# EAGLE design LightController (EAGLE 6.4)
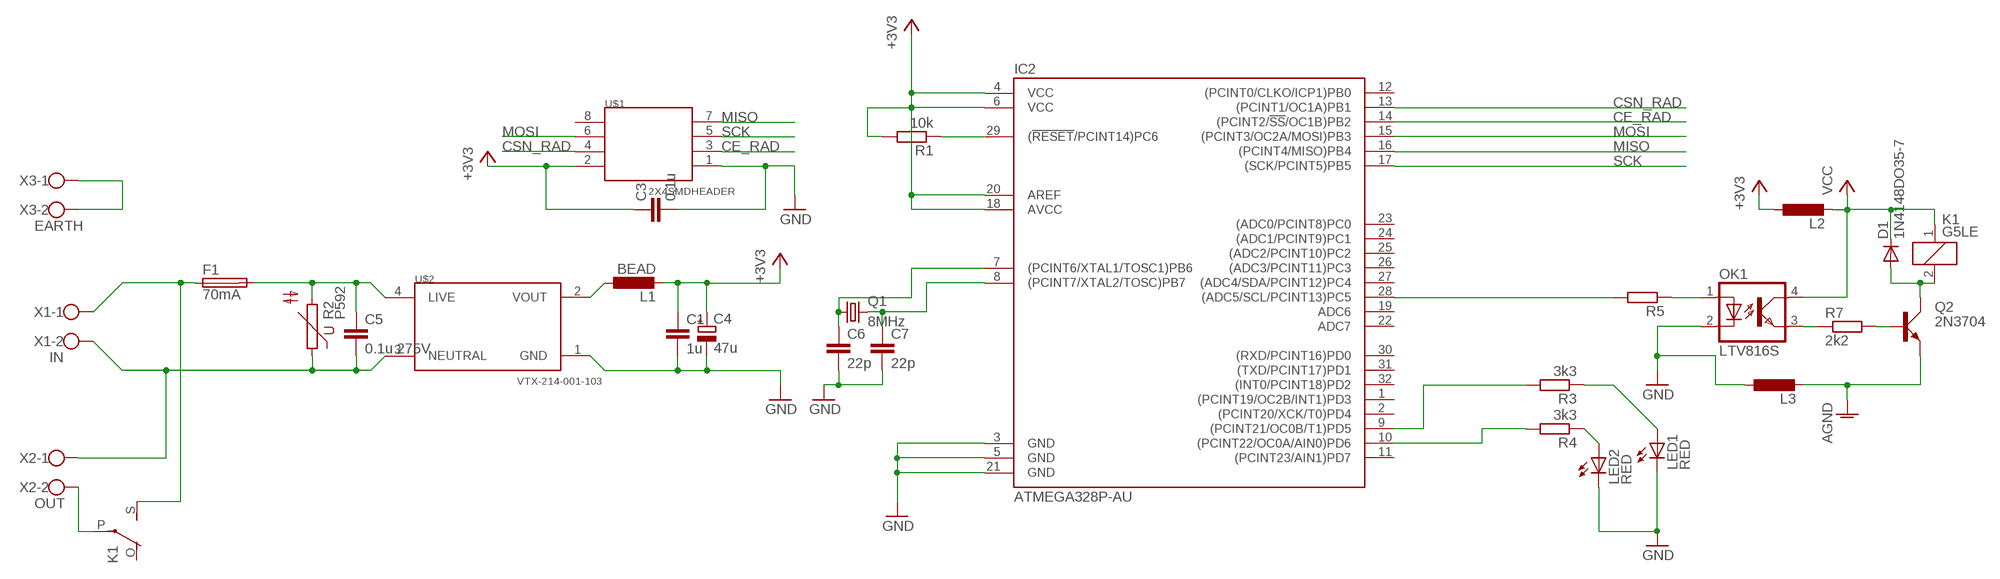
[diagram p0: schematic, sheet 1]

## Parts
C1  1u  C-EUC1206K  [C1206K]
C3  0.1u  C-EUC1206  [C1206]
C4  47u  CPOL-EUE2,5-6E  [E2,5-6E]
C5  0.1u 275V  C15/5  [C15B5]
C6  22p  C-EUC1206  [C1206]
C7  22p  C-EUC1206  [C1206]
D1  1N4148DO35-7  [DO35-7]
F1  70mA  FUSESH22,5A  [SH22,5A]
IC2  ATMEGA328P-AU  [TQFP32-08]
K1  G5LE  [G5LE]
L1  BEAD  L-EUL3230M  [L3230M]
L2  L-EUL3230M  [L3230M]
L3  L-EUL3230M  [L3230M]
LED1  RED  LEDSMT1206  [1206]
LED2  RED  LEDSMT1206  [1206]
OK1  LTV816S  [DIL4-SMD]
Q1  8MHz  CRYSTALHC49U70  [HC49U70]
Q2  2N3704  [TO92C]
R1  10k  R-EU_R1206  [R1206]
R2  P592  [P592]
R3  3k3  R-EU_R1206  [R1206]
R4  3k3  R-EU_R1206  [R1206]
R5  R-EU_R1206  [R1206]
R7  2k2  R-EU_R1206  [R1206]
U$1  2X4SMDHEADER  [TSM-110-XX-XXX-DV]
U$2  VTX-214-001-103  [VTX214001103]
X1  IN  W237-102  [W237-102]
X2  OUT  W237-102  [W237-102]
X3  EARTH  W237-102  [W237-102]

## Nets
+3V3: C1.1 C3.1 C4.+ IC2.4(VCC) IC2.6(VCC) IC2.18(AVCC) IC2.20(AREF) L1.2 L2.1 R1.2 U$1.2
AGND: L3.2 Q2.E
CE_RAD: IC2.14((PCINT2/!SS!/OC1B)PB2) U$1.3
CSN_RAD: IC2.13((PCINT1/OC1A)PB1) U$1.4
GND: C1.2 C3.2 C4.- C6.2 C7.2 IC2.3(GND) IC2.5(GND) IC2.21(GND) L3.1 LED1.C LED2.C OK1.2(C) U$1.1 U$2.1(GND)
MISO: IC2.16((PCINT4/MISO)PB4) U$1.7
MOSI: IC2.15((PCINT3/OC2A/MOSI)PB3) U$1.6
N$1: F1.1 K1.S(2:S) X1.1
N$2: C5.1 F1.2 R2.2 U$2.4(LIVE)
N$3: IC2.29((!RESET!/PCINT14)PC6) R1.1
N$4: C5.2 R2.1 U$2.3(NEUTRAL) X1.2 X2.1
N$5: IC2.10((PCINT22/OC0A/AIN0)PD6) R4.2
N$6: LED1.A R3.1
N$7: IC2.28((ADC5/SCL/PCINT13)PC5) R5.2
N$8: C6.1 IC2.7((PCINT6/XTAL1/TOSC1)PB6) Q1.1
N$9: C7.1 IC2.8((PCINT7/XTAL2/TOSC)PB7) Q1.2
N$11: LED2.A R4.1
N$12: OK1.1(A) R5.1
N$13: K1.P(2:P) X2.2
N$14: X3.1 X3.2
N$15: OK1.3(EMIT) R7.1
N$16: D1.A K1.2 Q2.C
N$17: Q2.B R7.2
N$19: IC2.9((PCINT21/OC0B/T1)PD5) R3.2
SCK: IC2.17((SCK/PCINT5)PB5) U$1.5
VCC: D1.C K1.1 L2.2 OK1.4(COL)
VOUT: L1.1 U$2.2(VOUT)
Unconnected: IC2.1((PCINT19/OC2B/INT1)PD3) IC2.2((PCINT20/XCK/T0)PD4) IC2.11((PCINT23/AIN1)PD7) IC2.12((PCINT0/CLKO/ICP1)PB0) IC2.19(ADC6) IC2.22(ADC7) IC2.23((ADC0/PCINT8)PC0) IC2.24((ADC1/PCINT9)PC1) IC2.25((ADC2/PCINT10)PC2) IC2.26((ADC3/PCINT11)PC3) IC2.27((ADC4/SDA/PCINT12)PC4) IC2.30((RXD/PCINT16)PD0) IC2.31((TXD/PCINT17)PD1) IC2.32((INT0/PCINT18)PD2) K1.O(2:O) U$1.8

## Library data of the parts
C1 C3 C6 C7 = rcl:C-EU: CAPACITOR, European symbol
C4 = rcl:CPOL-EU: POLARIZED CAPACITOR, European symbol
C5 = capacitor-wima:C: CAPACITOR naming: grid - package width
D1 = diode:1N4148: DIODE high speed (Philips)
F1 = fuse:FUSE: Fuse; OC_FARNELL: unknown; OC_NEWARK: unknown
IC2 = ATMEGA328P:ATMEGA328P-
K1 = relay:G5LE: RELAY 1 x switch, 10 A/120 V AC, 8 A/30 V DC, Omron; OC_FARNELL: unknown; OC_NEWARK: unknown
L1-L3 = rcl:L-EU: INDUCTOR, European symbol
LED1 LED2 = led:LED: LED OSRAM: - CHIPLED LG R971, LG N971, LY N971, LG Q971, LY Q971, LO R971, LY R971 LH N974, LH R974 LS Q976, LO Q976, LY Q976 LO Q996 - Hyper CHIPLED LW Q18S LB Q993, LB Q99A, LB R99A - SideLED LS A670, LO A670, LY A670, LG A670, LP A670 LB A673, LV A673, LT A673, LW A673 LH A674 LY A675 LS A676, LA A676, LO A676, LY A676, LW A676 LS A679, LY A679, LG A679 - Hyper Micro SIDELED® LS Y876, LA Y876, LO Y876, LY Y876 LT Y87S - SmartLED LW L88C, LW L88S LB L89C, LB L89S, LG L890 LS L89K, LO L89K, LY L89K LS L896, LA L896, LO L896, LY L896 - TOPLED LS T670, LO T670, LY T670, LG T670, LP T670 LSG T670, LSP T670, LSY T670, LOP T670, LYG T670 LG T671, LOG T671, LSG T671 LB T673, LV T673, LT T673, LW T673 LH T674 LS T676, LA T676, LO T676, LY T676, LB T676, LH T676, LSB T676, LW T676 LB T67C, LV T67C, LT T67C, LS T67K, LO T67K, LY T67K, LW E67C LS E67B, LA E67B, LO E67B, LY E67B, LB E67C, LV E67C, LT E67C LW T67C LS T679, LY T679, LG T679 LS T770, LO T770, LY T770, LG T770, LP T770 LB T773, LV T773, LT T773, LW T773 LH T774 LS E675, LA E675, LY E675, LS T675 LS T776, LA T776, LO T776, LY T776, LB T776 LHGB T686 LT T68C, LB T68C - Hyper Mini TOPLED® LB M676 - Mini TOPLED Santana® LG M470 LS M47K, LO M47K, LY M47K Source: http://www.osram.convergy.de LUXEON: - LUMILED® LXK2-PW12-R00, LXK2-PW12-S00, LXK2-PW14-U00, LXK2-PW14-V00 LXK2-PM12-R00, LXK2-PM12-S00, LXK2-PM14-U00 LXK2-PE12-Q00, LXK2-PE12-R00, LXK2-PE12-S00, LXK2-PE14-T00, LXK2-PE14-U00 LXK2-PB12-K00, LXK2-PB12-L00, LXK2-PB12-M00, LXK2-PB14-N00, LXK2-PB14-P00, LXK2-PB14-Q00 LXK2-PR12-L00, LXK2-PR12-M00, LXK2-PR14-Q00, LXK2-PR14-R00 LXK2-PD12-Q00, LXK2-PD12-R00, LXK2-PD12-S00 LXK2-PH12-R00, LXK2-PH12-S00 LXK2-PL12-P00, LXK2-PL12-Q00, LXK2-PL12-R00 Source: www.luxeon.com KINGBRIGHT: KA-3528ASYC Source: www.kingbright.com
OK1 = optocoupler:LTV816: OPTO COUPLER Source: LITEON, LTV816.pdf
Q1 = crystal:CRYSTAL: CRYSTAL; OC_FARNELL: unknown; OC_NEWARK: unknown
Q2 = transistor-small-signal:2N3704: NPN TRANSISTOR
R1 R3-R5 R7 = rcl:R-EU_: RESISTOR, European symbol
R2 = varistor:P592: VARISTOR
U$1 = Header:2X4SMDHEADER
U$2 = VTX214001103:VTX-214-001-103
X1-X3 = con-wago-500:W237-102: WAGO SCREW CLAMP; MPN: 237-102; OC_FARNELL: unknown; OC_NEWARK: 70K9898

## Board
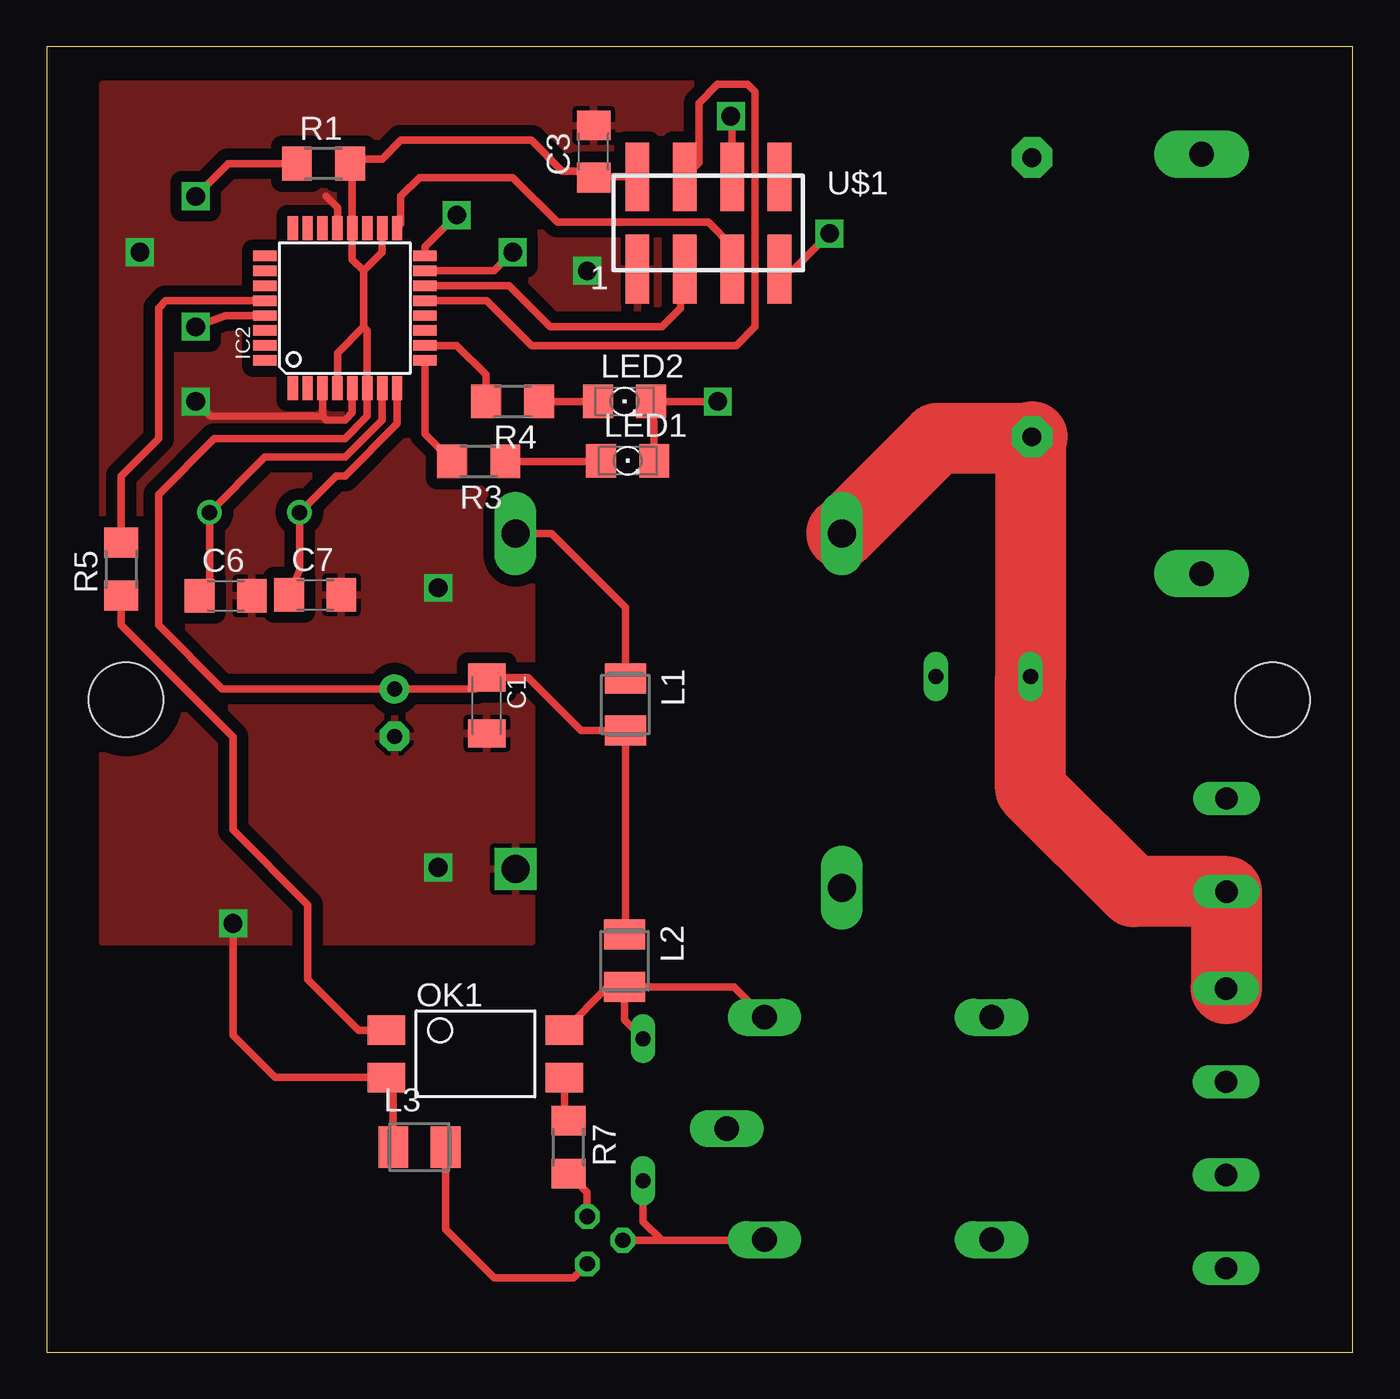
[diagram p1: board, top side]
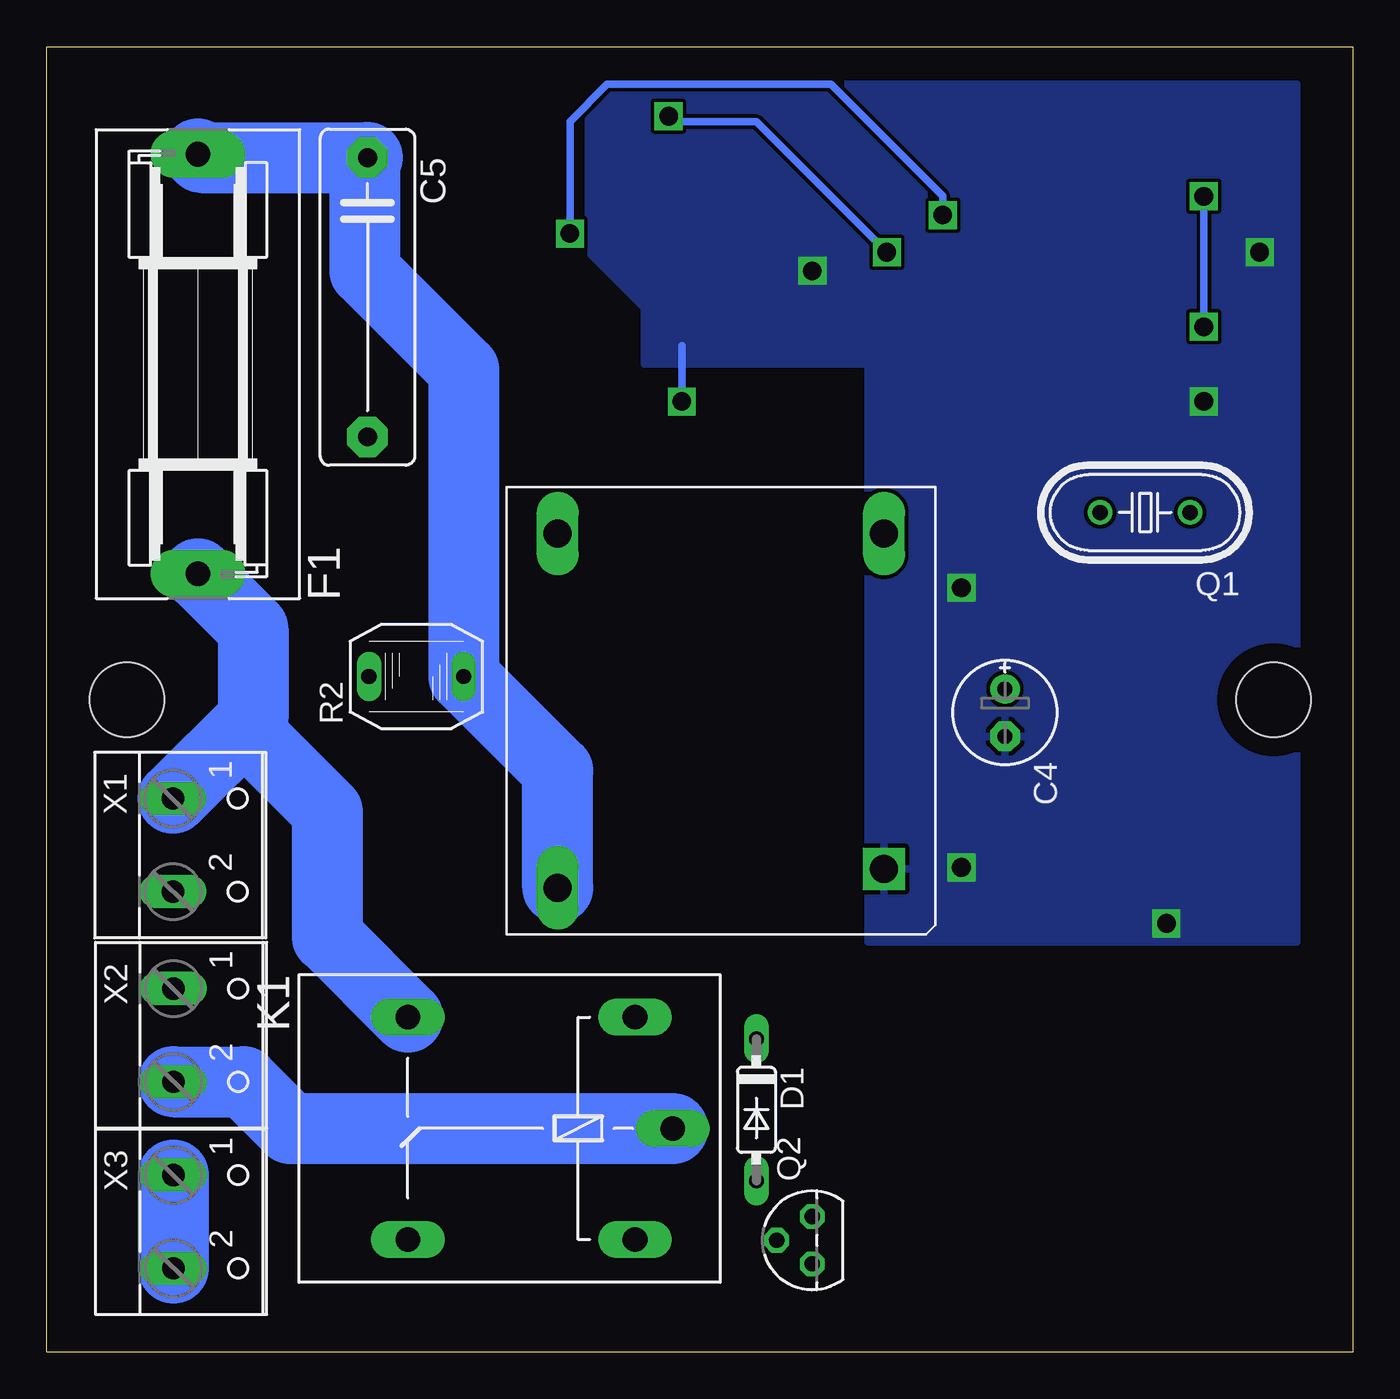
[diagram p2: board, bottom side, seen from below]

Size 70.07 x 70.03 mm. Coordinates in mm from the lower left corner, seen from the top.
Outline: 0,0 70.07,0 70.07,70.03 0,70.03 0,0
Copper layers (1*16): Top 0.035mm / dielectric 1.5mm / Bottom 0.035mm
Design rules "default": minimum track width 10mil, minimum drill 24mil, track to track 8mil, track to pad 8mil, pad to pad 8mil, via to via 8mil, smd to smd 8mil, copper to edge 40mil, drill to drill 8mil, minimum pad ring 10mil, minimum via ring 8mil, stop-mask expansion 4mil, vias tented up to drill 0mil, thermal gap 10mil
Holes 4 mm at 4.25,35 65.75,35

### Footprints (pad centres in the part's own frame; a part is rotated, then mirrored left to right if it is on the bottom)
C1206K = smd 1.5 x 2: 1 -1.5,0; 2 1.5,0
C1206 = smd 1.6 x 1.8: 1 -1.4,0; 2 1.4,0
E2,5-6E = drill 0.813 pad 1.575: + -1.27,0 | drill 0.813 pad 1.575 octagon: - 1.27,0
C15B5 = drill 1.016 pad 2.159 octagon: 1 -7.493,0; 2 7.493,0
DO35-7 = drill 0.813 long: A 3.81,0; C -3.81,0
SH22,5A = drill 1.321 pad 2.54 long: 1 -11.252,0; 2 11.252,0
TQFP32-08 = smd 1.27 x 0.559: 1 -4.293,2.8; 2 -4.293,2; 3 -4.293,1.2; 4 -4.293,0.4; 5 -4.293,-0.4; 6 -4.293,-1.2; 7 -4.293,-2; 8 -4.293,-2.8; 17 4.293,-2.8; 18 4.293,-2; 19 4.293,-1.2; 20 4.293,-0.4; 21 4.293,0.4; 22 4.293,1.2; 23 4.293,2; 24 4.293,2.8 | smd 0.559 x 1.27: 9 -2.8,-4.293; 10 -2,-4.293; 11 -1.2,-4.293; 12 -0.4,-4.293; 13 0.4,-4.293; 14 1.2,-4.293; 15 2,-4.293; 16 2.8,-4.293; 25 2.8,4.293; 26 2,4.293; 27 1.2,4.293; 28 0.4,4.293; 29 -0.4,4.293; 30 -1.2,4.293; 31 -2,4.293; 32 -2.8,4.293
G5LE = drill 1.321 long: 1 -7.493,-5.969; 2 -7.493,5.969; O 4.699,5.969; P -9.525,0; S 4.699,-5.969
L3230M = smd 1.6 x 2.2: 1 -1.4,0; 2 1.4,0
1206 = smd 1.6 x 1.803: A -1.422,0; C 1.422,0
DIL4-SMD = smd 1.6 x 2: 1 -1.27,-4.77; 2 1.27,-4.77; 3 1.27,4.77; 4 -1.27,4.77
HC49U70 = drill 0.813: 1 -2.413,0; 2 2.413,0
TO92C = drill 0.813 octagon: B 1.27,0; C 0,1.905; E -1.27,0
R1206 = smd 1.6 x 1.803: 1 -1.422,0; 2 1.422,0
P592 = drill 0.813 long: 1 0,2.54; 2 0,-2.54
TSM-110-XX-XXX-DV = smd 1.27 x 3.683: 1 -3.81,-2.731; 2 -3.81,2.223; 3 -1.27,-2.731; 4 -1.27,2.223; 5 1.27,-2.731; 6 1.27,2.223; 7 3.81,-2.731; 8 3.81,2.223
VTX214001103 = drill 1.5 square: 1 8.75,-8.5 | drill 1.5 long: 2 8.75,9.5; 3 -8.75,9.5; 4 -8.75,-9.5
W237-102 = drill 1.194 long: 1 -2.5,-1.27; 2 2.5,-1.27

### Placement (x,y rotation side)
C1  23.61,34.68 270 top
C3  29.34,64.4 90 top
C4  18.66,34.3 270 bottom
C5  52.86,56.59 270 bottom
C6  9.61,40.58 0 top
C7  14.41,40.62 0 top
D1  32,13 270 bottom
F1  61.95,53.01 90 bottom
IC2  16,56 90 top
K1  46,12 180 bottom
L1  31.05,34.74 270 top
L2  31,21 270 top
L3  20,11 0 top
LED1  31.17,47.82 0 top
LED2  31,51 0 top
OK1  23,16 270 top
Q1  11.15,45.04 180 bottom
Q2  29,6 90 bottom
R1  14.85,63.75 0 top
R2  50.24,36.24 90 bottom
R3  23.18,47.78 180 top
R4  25,51 180 top
R5  4,42 90 top
R7  28,11 270 top
U$1  35.5,60.82 0 top
U$2  33.9,34.41 0 bottom
X1  62.03,27.2 270 bottom
X2  62,17 270 bottom
X3  62,7 270 bottom

### Tracks (layer width: path | path; a pad name or v marks a point on that pad's centre or on a via)
+3V3
  Top 0.406: L2.1 31.05,22.45 L1.2 28.66,33.34 25.82,36.18 C1.1 23,35.57 C4.+ 9.43,35.57 6,39 6,46 9,49 16,49 17.2,50.2 IC2.6 17.2,54.8 17,55 | IC2.4 15.6,53.6 17,55 | 17,55 17,58 | 17,58 16.4,58.6 IC2.20 16.4,63.62 R1.2 16.52,64 18,64 19,65 26,65 27.66,63.34 28.66,63.34 C3.1 29.7,63.04 U$1.2 | IC2.18 18,59 17,58
AGND
  Top 0.406: L3.2 21.4,6.6 24,4 28.27,4 Q2.E
CE_RAD
  Top 0.406: U$1.3 34,57.86 34,56 33,55 27,55 24.8,57.2 IC2.14
CSN_RAD
  Top 0.406: 34,63.27 U$1.4 35,63.81 35,67 36,68 37.6,68 38,67.6 38,55 37,54 26,54 23.6,56.4 IC2.13
GND  (via drill 1)
  Top 0.406: L3.1 18.6,14.36 OK1.2 12.27,14.73 10,17 v10,23 | LED1.C 32.59,49.83 LED2.C v36,51 | 16.4,51.4 IC2.5 16.4,50.4 16,50 15,50 14.8,50.2 | IC2.3 14.8,50.2 | IC2.21 15.6,61.4 15,62 | v8,51 8.8,50.2 14.8,50.2
  Bottom 0.406: 36,54 v36,51
  other vias: 21,26 5,59 29,58 21,41
  pour Top (isolate 0.61): 3,22 26,22 26,53 41,53 41,68 3,68
  pour Bottom: 3,68 3,22 26,22 26,53 38,53 38,56 41,59 41,68
MISO  (via drill 1)
  Top 0.406: IC2.16 20.29,59.29 v22,61 | U$1.7 40.09,58.09 v42,60
  Bottom 0.406: v22,61 22,62 28,68 40,68 42,66 v42,60
MOSI  (via drill 1)
  Top 0.406: IC2.15 24,58 v25,59 | U$1.6 36.77,66.23 v36.7,66.3
  Bottom 0.406: v25,59 32,66 36.4,66 v36.7,66.3
N$1
  Bottom 3.81: F1.1 59,38.81 59,34 | 59,34 X1.1 | 59,34 59,33 55,29 55,22.27 K1.S
N$2
  Bottom 3.81: F1.2 61.77,64.08 C5.1 53,63.94 53,58 47.7,52.7 R2.2 42.65,31.19 U$2.4
N$3  (via drill 1)
  Top 0.406: IC2.29 9.6,55.6 v8,55 | R1.1 9.75,63.75 v8,62
  Bottom 0.406: v8,62 v8,55
N$4
  Top 3.81: C5.2 52.78,49.02 | 52.78,49.02 R2.1 52.78,30.22 58.3,24.7 X1.2 63.3,19.53 X2.1 | 52.78,49.02 47.76,49.02 U$2.3
N$5
  Top 0.406: R4.2 23.58,52.42 22,54 IC2.10
N$6
  Top 0.406: R3.1 29.71,47.78 LED1.A
N$7
  Top 0.406: R5.2 4,47 6,49 6,56 6.4,56.4 IC2.28
N$8
  Top 0.406: C6.1 8.74,41.37 Q1.1 11.7,48 16,48 18,50 IC2.7
N$9
  Top 0.406: C7.1 13.56,41.95 Q1.2 15.52,47 16,47 18.8,49.8 IC2.8
N$11
  Top 0.406: LED2.A R4.1
N$12
  Top 0.406: OK1.1 16.73,17.27 14,20 14,24 10,28 10,33 4,39 R5.1
N$13
  Bottom 3.81: X2.2 59.5,14.5 57,12 K1.P
N$14
  Bottom 3.81: X3.1 X3.2
N$15
  Top 0.406: OK1.3 27.77,12.65 R7.1
N$16
  Top 0.406: Q2.C 33,6 | 33,6 38.48,6 K1.2 | D1.A 32,7 33,6
N$17
  Top 0.406: Q2.B 29,8.58 R7.2
N$19
  Top 0.406: IC2.9 20.29,49.24 R3.2
SCK
  Top 0.406: IC2.17 19,60.49 19,62 20,63 25,63 27.4,60.6 35.5,60.6 36.77,59.33 U$1.5
VCC
  Top 0.406: L2.2 30.1,19.6 OK1.4 | L2.2 36.88,19.6 K1.1 | L2.2 31,17.81 D1.C
VOUT
  Top 0.406: U$2.2 27.09,43.91 31.05,39.95 L1.1